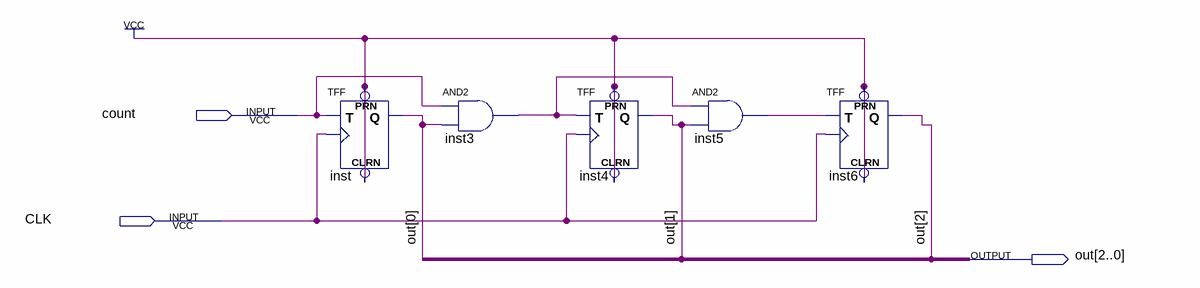
[diagram p0: schematic sheet]
// Quartus schematic contador-3bits.bdf as structural Verilog: 5 symbols, 3 pins
module \contador-3bits  (
  input  count,
  input  CLK,
  output [2:0] out
);

  wire inst3_out, inst5_out;

  TFF inst (.PRN(1'b1), .CLRN(1'b1), .T(count), .CLK(CLK), .Q(out[0]));
  and inst3 (inst3_out, count, out[0]);
  TFF inst4 (.PRN(1'b1), .CLRN(1'b1), .T(inst3_out), .CLK(CLK), .Q(out[1]));
  and inst5 (inst5_out, inst3_out, out[1]);
  TFF inst6 (.PRN(1'b1), .CLRN(1'b1), .T(inst5_out), .CLK(CLK), .Q(out[2]));
endmodule
